# Altium schematic sheet DI_24V_DC.SchDoc
size A3
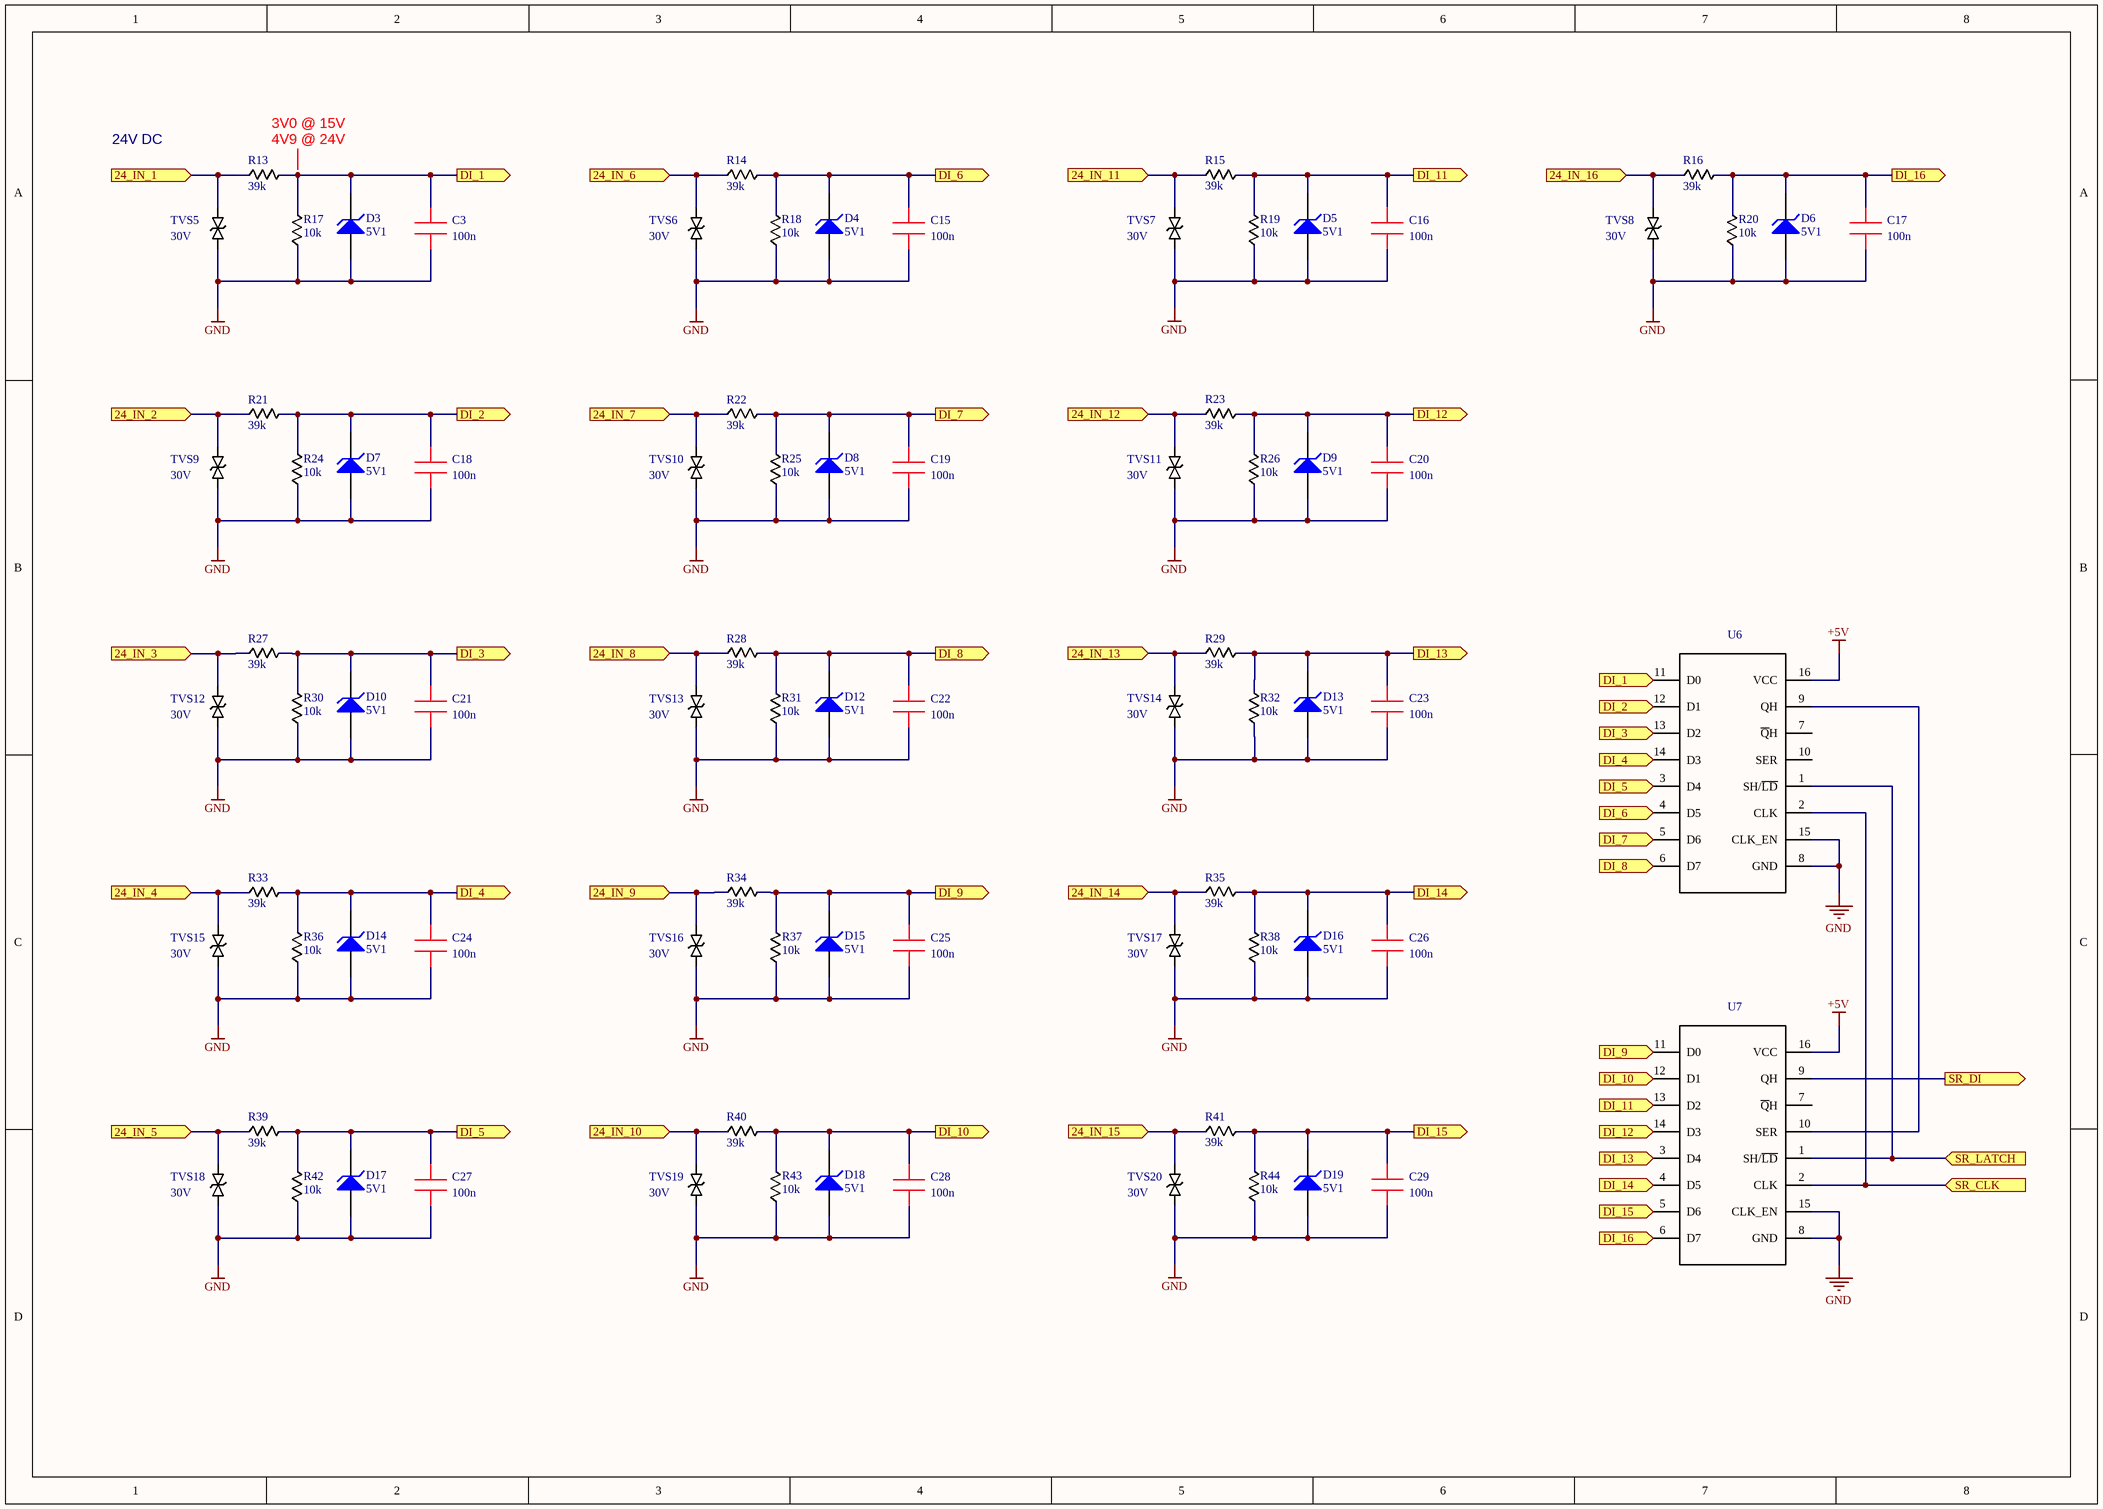
[diagram p0: DI_24V_DC.SchDoc]

## Parts
C3  100n  [0603_CAP]
C15  100n  [0603_CAP]
C16  100n  [0603_CAP]
C17  100n  [0603_CAP]
C18  100n  [0603_CAP]
C19  100n  [0603_CAP]
C20  100n  [0603_CAP]
C21  100n  [0603_CAP]
C22  100n  [0603_CAP]
C23  100n  [0603_CAP]
C24  100n  [0603_CAP]
C25  100n  [0603_CAP]
C26  100n  [0603_CAP]
C27  100n  [0603_CAP]
C28  100n  [0603_CAP]
C29  100n  [0603_CAP]
D3  5V1  [SOT23]
D4  5V1  [SOT23]
D5  5V1  [SOT23]
D6  5V1  [SOT23]
D7  5V1  [SOT23]
D8  5V1  [SOT23]
D9  5V1  [SOT23]
D10  5V1  [SOT23]
D12  5V1  [SOT23]
D13  5V1  [SOT23]
D14  5V1  [SOT23]
D15  5V1  [SOT23]
D16  5V1  [SOT23]
D17  5V1  [SOT23]
D18  5V1  [SOT23]
D19  5V1  [SOT23]
R13  39k  [0603_RES]
R14  39k  [0603_RES]
R15  39k  [0603_RES]
R16  39k  [0603_RES]
R17  10k  [0603_RES]
R18  10k  [0603_RES]
R19  10k  [0603_RES]
R20  10k  [0603_RES]
R21  39k  [0603_RES]
R22  39k  [0603_RES]
R23  39k  [0603_RES]
R24  10k  [0603_RES]
R25  10k  [0603_RES]
R26  10k  [0603_RES]
R27  39k  [0603_RES]
R28  39k  [0603_RES]
R29  39k  [0603_RES]
R30  10k  [0603_RES]
R31  10k  [0603_RES]
R32  10k  [0603_RES]
R33  39k  [0603_RES]
R34  39k  [0603_RES]
R35  39k  [0603_RES]
R36  10k  [0603_RES]
R37  10k  [0603_RES]
R38  10k  [0603_RES]
R39  39k  [0603_RES]
R40  39k  [0603_RES]
R41  39k  [0603_RES]
R42  10k  [0603_RES]
R43  10k  [0603_RES]
R44  10k  [0603_RES]
TVS5  30V  [DO-214AC]
TVS6  30V  [DO-214AC]
TVS7  30V  [DO-214AC]
TVS8  30V  [DO-214AC]
TVS9  30V  [DO-214AC]
TVS10  30V  [DO-214AC]
TVS11  30V  [DO-214AC]
TVS12  30V  [DO-214AC]
TVS13  30V  [DO-214AC]
TVS14  30V  [DO-214AC]
TVS15  30V  [DO-214AC]
TVS16  30V  [DO-214AC]
TVS17  30V  [DO-214AC]
TVS18  30V  [DO-214AC]
TVS19  30V  [DO-214AC]
TVS20  30V  [DO-214AC]
U6  (no value)  [SOIC 16]
U7  (no value)  [SOIC 16]

## Ports
24_IN_1, 24_IN_2, 24_IN_3, 24_IN_4, 24_IN_5, 24_IN_6, 24_IN_7, 24_IN_8, 24_IN_9, 24_IN_10, 24_IN_11, 24_IN_12, 24_IN_13, 24_IN_14, 24_IN_15, 24_IN_16, DI_1, DI_2, DI_3, DI_4, DI_5, DI_6, DI_7, DI_8, DI_9, DI_10, DI_11, DI_12, DI_13, DI_14, DI_15, DI_16, SR_CLK, SR_DI, SR_LATCH

## Nets
+5V: U6.16(VCC) U7.16(VCC)
GND: C3.1 C15.1 C16.1 C17.1 C18.1 C19.1 C20.1 C21.1 C22.1 C23.1 C24.1 C25.1 C26.1 C27.1 C28.1 C29.1 D3.1(A) D4.1(A) D5.1(A) D6.1(A) D7.1(A) D8.1(A) D9.1(A) D10.1(A) D12.1(A) D13.1(A) D14.1(A) D15.1(A) D16.1(A) D17.1(A) D18.1(A) D19.1(A) R17.1 R18.1 R19.1 R20.1 R24.1 R25.1 R26.1 R30.1 R31.1 R32.1 R36.1 R37.1 R38.1 R42.1 R43.1 R44.1 TVS5.1 TVS6.1 TVS7.1 TVS8.1 TVS9.1 TVS10.1 TVS11.1 TVS12.1 TVS13.1 TVS14.1 TVS15.1 TVS16.1 TVS17.1 TVS18.1 TVS19.1 TVS20.1 U6.8(GND) U6.15(CLK_EN) U7.8(GND) U7.15(CLK_EN)
24_IN_1: R13.1 TVS5.2 ; port 24_IN_1
24_IN_2: R21.1 TVS9.2 ; port 24_IN_2
24_IN_3: R27.1 TVS12.2 ; port 24_IN_3
24_IN_4: R33.1 TVS15.2 ; port 24_IN_4
24_IN_5: R39.1 TVS18.2 ; port 24_IN_5
24_IN_6: R14.1 TVS6.2 ; port 24_IN_6
24_IN_7: R22.1 TVS10.2 ; port 24_IN_7
24_IN_8: R28.1 TVS13.2 ; port 24_IN_8
24_IN_9: R34.1 TVS16.2 ; port 24_IN_9
24_IN_10: R40.1 TVS19.2 ; port 24_IN_10
24_IN_11: R15.1 TVS7.2 ; port 24_IN_11
24_IN_12: R23.1 TVS11.2 ; port 24_IN_12
24_IN_13: R29.1 TVS14.2 ; port 24_IN_13
24_IN_14: R35.1 TVS17.2 ; port 24_IN_14
24_IN_15: R41.1 TVS20.2 ; port 24_IN_15
24_IN_16: R16.1 TVS8.2 ; port 24_IN_16
DI_1: C3.2 D3.2(K) R13.2 R17.2 U6.11(D0) ; port DI_1
DI_2: C18.2 D7.2(K) R21.2 R24.2 U6.12(D1) ; port DI_2
DI_3: C21.2 D10.2(K) R27.2 R30.2 U6.13(D2) ; port DI_3
DI_4: C24.2 D14.2(K) R33.2 R36.2 U6.14(D3) ; port DI_4
DI_5: C27.2 D17.2(K) R39.2 R42.2 U6.3(D4) ; port DI_5
DI_6: C15.2 D4.2(K) R14.2 R18.2 U6.4(D5) ; port DI_6
DI_7: C19.2 D8.2(K) R22.2 R25.2 U6.5(D6) ; port DI_7
DI_8: C22.2 D12.2(K) R28.2 R31.2 U6.6(D7) ; port DI_8
DI_9: C25.2 D15.2(K) R34.2 R37.2 U7.11(D0) ; port DI_9
DI_10: C28.2 D18.2(K) R40.2 R43.2 U7.12(D1) ; port DI_10
DI_11: C16.2 D5.2(K) R15.2 R19.2 U7.13(D2) ; port DI_11
DI_12: C20.2 D9.2(K) R23.2 R26.2 U7.14(D3) ; port DI_12
DI_13: C23.2 D13.2(K) R29.2 R32.2 U7.3(D4) ; port DI_13
DI_14: C26.2 D16.2(K) R35.2 R38.2 U7.4(D5) ; port DI_14
DI_15: C29.2 D19.2(K) R41.2 R44.2 U7.5(D6) ; port DI_15
DI_16: C17.2 D6.2(K) R16.2 R20.2 U7.6(D7) ; port DI_16
SR_CLK: U6.2(CLK) U7.2(CLK) ; port SR_CLK
SR_DI: U7.9(QH) ; port SR_DI
SR_LATCH: U6.1(SH/~{LD}) U7.1(SH/~{LD}) ; port SR_LATCH
NetU6_9: U6.9(QH) U7.10(SER)

Not connected (* = marked no-connect by the designer): U6 7(~{Q}H) 10(SER); U7 7(~{Q}H)

## Notes on the sheet
- 24V DC
- (near R13) 4V9 @ 24V
- (near R13) 3V0 @ 15V

## Library data of the parts
C3 C15-C29 = 0603 CAP: Part Description: Capacitor 0.1uF X7R 0603 10%; Part Number: CC0603KRX7R9BB104
D3-D10 D12-D19 = D Zener: pin to pad: 2>3; Part Description: Zener Diodes 5.1V 250mW; Part Number: BZX84C5V1LT1G
R13-R16 R21-R23 R27-R29 R33-R35 R39-R41 = 0603 RES: RC0603FR-0739KL; Part Description: Resistor 0603, 39kOhms, 1%, 1/10W; Part Number: RC0603FR-0739KL
R17-R20 R24-R26 R30-R32 R36-R38 R42-R44 = 0603 RES: Part Description: Resistor 0603, 10kOhms, 1%, 1/10W; Part Number: RC0603FR-0710KL
TVS5-TVS20 = TVS: Part Description: TVS Diodes 400W 30V 5% Bi-Directional; Part Number: SMAJ30CA
U6 U7 = 74HC165: Part Description: Counter Shift Register; Part Number: 74HC165D.653